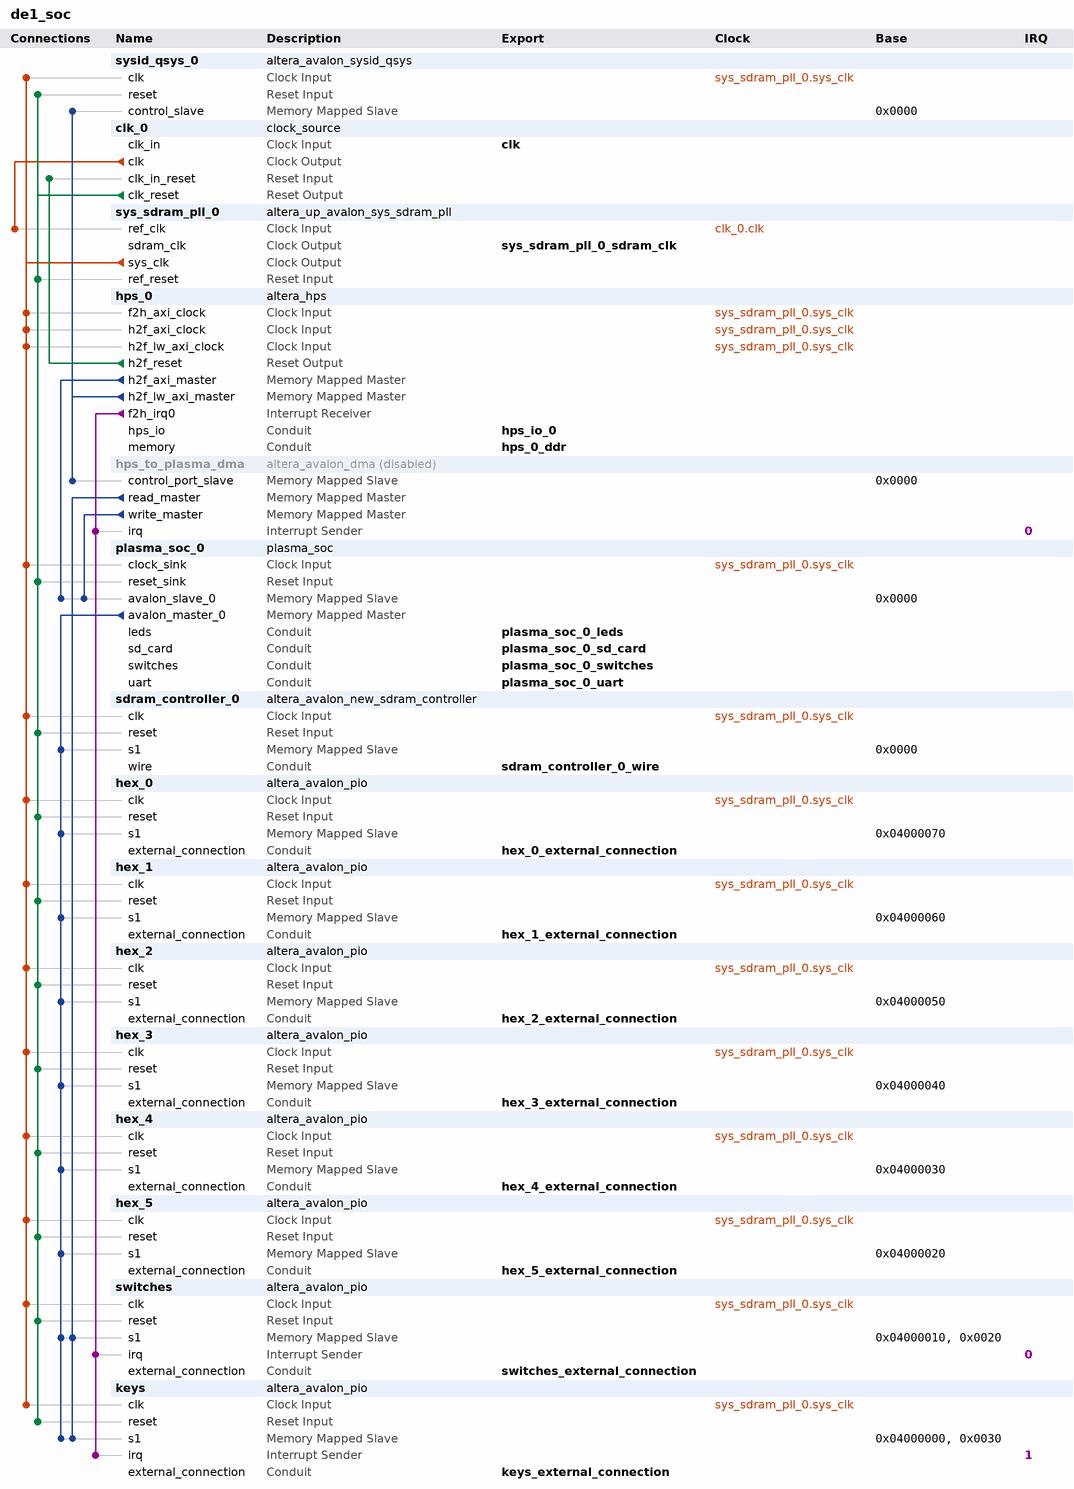
[diagram p0: system contents]
# Platform Designer (Qsys) system de1_soc, Cyclone V 5CSEMA5F31C6
# Parameters at their usual value, and those the tool derives, are not listed.
package require -exact qsys 18.0
create_system de1_soc
set_project_property DEVICE_FAMILY {Cyclone V}
set_project_property DEVICE 5CSEMA5F31C6

add_instance sysid_qsys_0 altera_avalon_sysid_qsys 18.0
set_instance_parameter_value sysid_qsys_0 id -559038737

add_instance clk_0 clock_source 18.0
set_instance_parameter_value clk_0 clockFrequency 50000000

add_instance sys_sdram_pll_0 altera_up_avalon_sys_sdram_pll 18.0
set_instance_parameter_value sys_sdram_pll_0 CV_boards DE1-SoC
set_instance_parameter_value sys_sdram_pll_0 gui_outclk 50.0
set_instance_parameter_value sys_sdram_pll_0 gui_refclk 50.0

add_instance hps_0 altera_hps 18.0
set_instance_parameter_value hps_0 EMAC1_Mode RGMII
set_instance_parameter_value hps_0 EMAC1_PinMuxing {HPS I/O Set 0}
set_instance_parameter_value hps_0 F2SCLK_COLDRST_Enable false
set_instance_parameter_value hps_0 F2SCLK_DBGRST_Enable false
set_instance_parameter_value hps_0 F2SCLK_WARMRST_Enable false
set_instance_parameter_value hps_0 F2SINTERRUPT_Enable true
set_instance_parameter_value hps_0 F2S_Width 3
set_instance_parameter_value hps_0 FPGA_PERIPHERAL_OUTPUT_CLOCK_FREQ_EMAC0_GTX_CLK 125
set_instance_parameter_value hps_0 FPGA_PERIPHERAL_OUTPUT_CLOCK_FREQ_EMAC0_MD_CLK 2.5
set_instance_parameter_value hps_0 FPGA_PERIPHERAL_OUTPUT_CLOCK_FREQ_EMAC1_GTX_CLK 125
set_instance_parameter_value hps_0 FPGA_PERIPHERAL_OUTPUT_CLOCK_FREQ_EMAC1_MD_CLK 2.5
set_instance_parameter_value hps_0 HPS_PROTOCOL DDR3
set_instance_parameter_value hps_0 I2C0_Mode I2C
set_instance_parameter_value hps_0 I2C0_PinMuxing {HPS I/O Set 0}
set_instance_parameter_value hps_0 I2C1_Mode I2C
set_instance_parameter_value hps_0 I2C1_PinMuxing {HPS I/O Set 0}
set_instance_parameter_value hps_0 LWH2F_Enable true
set_instance_parameter_value hps_0 MEM_BANKADDR_WIDTH 3
set_instance_parameter_value hps_0 MEM_CLK_FREQ 400.0
set_instance_parameter_value hps_0 MEM_COL_ADDR_WIDTH 10
set_instance_parameter_value hps_0 MEM_DQ_WIDTH 32
set_instance_parameter_value hps_0 MEM_DRV_STR RZQ/7
set_instance_parameter_value hps_0 MEM_ROW_ADDR_WIDTH 15
set_instance_parameter_value hps_0 MEM_RTT_NOM RZQ/4
set_instance_parameter_value hps_0 MEM_RTT_WR RZQ/4
set_instance_parameter_value hps_0 MEM_TCL 11
set_instance_parameter_value hps_0 MEM_TFAW_NS 30.0
set_instance_parameter_value hps_0 MEM_TRAS_NS 35.0
set_instance_parameter_value hps_0 MEM_TRCD_NS 13.75
set_instance_parameter_value hps_0 MEM_TRFC_NS 260.0
set_instance_parameter_value hps_0 MEM_TRP_NS 13.75
set_instance_parameter_value hps_0 MEM_VENDOR Other
set_instance_parameter_value hps_0 MEM_WTCL 8
set_instance_parameter_value hps_0 QSPI_Mode {1 SS}
set_instance_parameter_value hps_0 QSPI_PinMuxing {HPS I/O Set 0}
set_instance_parameter_value hps_0 REF_CLK_FREQ 50.0
set_instance_parameter_value hps_0 S2FCLK_USER2CLK 5
set_instance_parameter_value hps_0 S2F_Width 3
set_instance_parameter_value hps_0 SDIO_Mode {4-bit Data}
set_instance_parameter_value hps_0 SDIO_PinMuxing {HPS I/O Set 0}
set_instance_parameter_value hps_0 SPIM1_Mode {Single Slave Select}
set_instance_parameter_value hps_0 SPIM1_PinMuxing {HPS I/O Set 0}
set_instance_parameter_value hps_0 STM_Enable false
set_instance_parameter_value hps_0 TIMING_BOARD_AC_SKEW 0.02
set_instance_parameter_value hps_0 TIMING_BOARD_AC_TO_CK_SKEW 0.01
set_instance_parameter_value hps_0 TIMING_BOARD_DQ_TO_DQS_SKEW 0.05
set_instance_parameter_value hps_0 TIMING_BOARD_MAX_CK_DELAY 0.03
set_instance_parameter_value hps_0 TIMING_BOARD_MAX_DQS_DELAY 0.02
set_instance_parameter_value hps_0 TIMING_BOARD_SKEW_BETWEEN_DQS 0.06
set_instance_parameter_value hps_0 TIMING_BOARD_SKEW_CKDQS_DIMM_MAX 0.12
set_instance_parameter_value hps_0 TIMING_BOARD_SKEW_CKDQS_DIMM_MIN 0.06
set_instance_parameter_value hps_0 TIMING_BOARD_SKEW_WITHIN_DQS 0.01
set_instance_parameter_value hps_0 TIMING_TDH 65
set_instance_parameter_value hps_0 TIMING_TDQSCK 255
set_instance_parameter_value hps_0 TIMING_TDQSQ 125
set_instance_parameter_value hps_0 TIMING_TDS 30
set_instance_parameter_value hps_0 TIMING_TIH 140
set_instance_parameter_value hps_0 TIMING_TIS 180
set_instance_parameter_value hps_0 TIMING_TQSH 0.4
set_instance_parameter_value hps_0 UART0_Mode {No Flow Control}
set_instance_parameter_value hps_0 UART0_PinMuxing {HPS I/O Set 0}
set_instance_parameter_value hps_0 USB1_Mode SDR
set_instance_parameter_value hps_0 USB1_PinMuxing {HPS I/O Set 0}
set_instance_parameter_value hps_0 desired_cfg_clk_mhz 100.0
set_instance_parameter_value hps_0 desired_qspi_clk_mhz 400.0

add_instance hps_to_plasma_dma altera_avalon_dma 18.0
set_instance_property hps_to_plasma_dma ENABLED false
set_instance_parameter_value hps_to_plasma_dma allowByteTransactions true
set_instance_parameter_value hps_to_plasma_dma allowDoubleWordTransactions true
set_instance_parameter_value hps_to_plasma_dma allowHalfWordTransactions true
set_instance_parameter_value hps_to_plasma_dma allowQuadWordTransactions true
set_instance_parameter_value hps_to_plasma_dma burstEnable false
set_instance_parameter_value hps_to_plasma_dma fifoDepth 32
set_instance_parameter_value hps_to_plasma_dma maxBurstSize 128
set_instance_parameter_value hps_to_plasma_dma minimumDmaTransactionRegisterWidth 13

add_instance plasma_soc_0 plasma_soc 1.0

add_instance sdram_controller_0 altera_avalon_new_sdram_controller 18.0
set_instance_parameter_value sdram_controller_0 TAC 5.4
set_instance_parameter_value sdram_controller_0 TRCD 15.0
set_instance_parameter_value sdram_controller_0 TRP 15.0
set_instance_parameter_value sdram_controller_0 casLatency 3
set_instance_parameter_value sdram_controller_0 columnWidth 10
set_instance_parameter_value sdram_controller_0 dataWidth 16
set_instance_parameter_value sdram_controller_0 generateSimulationModel true
set_instance_parameter_value sdram_controller_0 model single_Micron_MT48LC4M32B2_7_chip
set_instance_parameter_value sdram_controller_0 numberOfBanks 4
set_instance_parameter_value sdram_controller_0 numberOfChipSelects 1
set_instance_parameter_value sdram_controller_0 powerUpDelay 100.0
set_instance_parameter_value sdram_controller_0 refreshPeriod 7.8125
set_instance_parameter_value sdram_controller_0 rowWidth 13

add_instance hex_0 altera_avalon_pio 18.0
set_instance_parameter_value hex_0 direction Output
set_instance_parameter_value hex_0 width 7

add_instance hex_1 altera_avalon_pio 18.0
set_instance_parameter_value hex_1 direction Output
set_instance_parameter_value hex_1 width 7

add_instance hex_2 altera_avalon_pio 18.0
set_instance_parameter_value hex_2 direction Output
set_instance_parameter_value hex_2 width 7

add_instance hex_3 altera_avalon_pio 18.0
set_instance_parameter_value hex_3 direction Output
set_instance_parameter_value hex_3 width 7

add_instance hex_4 altera_avalon_pio 18.0
set_instance_parameter_value hex_4 direction Output
set_instance_parameter_value hex_4 width 7

add_instance hex_5 altera_avalon_pio 18.0
set_instance_parameter_value hex_5 direction Output
set_instance_parameter_value hex_5 width 7

add_instance switches altera_avalon_pio 18.0
set_instance_parameter_value switches direction Input
set_instance_parameter_value switches generateIRQ true
set_instance_parameter_value switches width 10

add_instance keys altera_avalon_pio 18.0
set_instance_parameter_value keys direction Input
set_instance_parameter_value keys generateIRQ true
set_instance_parameter_value keys width 4

# connections
add_connection clk_0.clk sys_sdram_pll_0.ref_clk clock
add_connection sys_sdram_pll_0.sys_clk hex_0.clk clock
add_connection sys_sdram_pll_0.sys_clk hex_1.clk clock
add_connection sys_sdram_pll_0.sys_clk hex_2.clk clock
add_connection sys_sdram_pll_0.sys_clk hex_3.clk clock
add_connection sys_sdram_pll_0.sys_clk hex_4.clk clock
add_connection sys_sdram_pll_0.sys_clk hex_5.clk clock
add_connection sys_sdram_pll_0.sys_clk hps_0.f2h_axi_clock clock
add_connection sys_sdram_pll_0.sys_clk hps_0.h2f_axi_clock clock
add_connection sys_sdram_pll_0.sys_clk hps_0.h2f_lw_axi_clock clock
add_connection sys_sdram_pll_0.sys_clk keys.clk clock
add_connection sys_sdram_pll_0.sys_clk plasma_soc_0.clock_sink clock
add_connection sys_sdram_pll_0.sys_clk sdram_controller_0.clk clock
add_connection sys_sdram_pll_0.sys_clk switches.clk clock
add_connection sys_sdram_pll_0.sys_clk sysid_qsys_0.clk clock
add_connection clk_0.clk_reset hex_0.reset reset
add_connection clk_0.clk_reset hex_1.reset reset
add_connection clk_0.clk_reset hex_2.reset reset
add_connection clk_0.clk_reset hex_3.reset reset
add_connection clk_0.clk_reset hex_4.reset reset
add_connection clk_0.clk_reset hex_5.reset reset
add_connection clk_0.clk_reset keys.reset reset
add_connection clk_0.clk_reset plasma_soc_0.reset_sink reset
add_connection clk_0.clk_reset sdram_controller_0.reset reset
add_connection clk_0.clk_reset switches.reset reset
add_connection clk_0.clk_reset sys_sdram_pll_0.ref_reset reset
add_connection clk_0.clk_reset sysid_qsys_0.reset reset
add_connection hps_0.h2f_reset clk_0.clk_in_reset reset
add_connection hps_0.h2f_axi_master plasma_soc_0.avalon_slave_0 avalon
set_connection_parameter_value hps_0.h2f_axi_master/plasma_soc_0.avalon_slave_0 baseAddress 0x0000
add_connection hps_0.h2f_lw_axi_master hps_to_plasma_dma.control_port_slave avalon
set_connection_parameter_value hps_0.h2f_lw_axi_master/hps_to_plasma_dma.control_port_slave baseAddress 0x0000
add_connection hps_0.h2f_lw_axi_master sysid_qsys_0.control_slave avalon
set_connection_parameter_value hps_0.h2f_lw_axi_master/sysid_qsys_0.control_slave baseAddress 0x0000
add_connection hps_to_plasma_dma.read_master keys.s1 avalon
set_connection_parameter_value hps_to_plasma_dma.read_master/keys.s1 baseAddress 0x0030
add_connection hps_to_plasma_dma.read_master switches.s1 avalon
set_connection_parameter_value hps_to_plasma_dma.read_master/switches.s1 baseAddress 0x0020
add_connection hps_to_plasma_dma.write_master plasma_soc_0.avalon_slave_0 avalon
set_connection_parameter_value hps_to_plasma_dma.write_master/plasma_soc_0.avalon_slave_0 baseAddress 0x0000
add_connection plasma_soc_0.avalon_master_0 hex_0.s1 avalon
set_connection_parameter_value plasma_soc_0.avalon_master_0/hex_0.s1 baseAddress 0x04000070
add_connection plasma_soc_0.avalon_master_0 hex_1.s1 avalon
set_connection_parameter_value plasma_soc_0.avalon_master_0/hex_1.s1 baseAddress 0x04000060
add_connection plasma_soc_0.avalon_master_0 hex_2.s1 avalon
set_connection_parameter_value plasma_soc_0.avalon_master_0/hex_2.s1 baseAddress 0x04000050
add_connection plasma_soc_0.avalon_master_0 hex_3.s1 avalon
set_connection_parameter_value plasma_soc_0.avalon_master_0/hex_3.s1 baseAddress 0x04000040
add_connection plasma_soc_0.avalon_master_0 hex_4.s1 avalon
set_connection_parameter_value plasma_soc_0.avalon_master_0/hex_4.s1 baseAddress 0x04000030
add_connection plasma_soc_0.avalon_master_0 hex_5.s1 avalon
set_connection_parameter_value plasma_soc_0.avalon_master_0/hex_5.s1 baseAddress 0x04000020
add_connection plasma_soc_0.avalon_master_0 keys.s1 avalon
set_connection_parameter_value plasma_soc_0.avalon_master_0/keys.s1 baseAddress 0x04000000
add_connection plasma_soc_0.avalon_master_0 sdram_controller_0.s1 avalon
set_connection_parameter_value plasma_soc_0.avalon_master_0/sdram_controller_0.s1 baseAddress 0x0000
add_connection plasma_soc_0.avalon_master_0 switches.s1 avalon
set_connection_parameter_value plasma_soc_0.avalon_master_0/switches.s1 baseAddress 0x04000010
add_connection hps_0.f2h_irq0 hps_to_plasma_dma.irq interrupt
set_connection_parameter_value hps_0.f2h_irq0/hps_to_plasma_dma.irq irqNumber 0
add_connection hps_0.f2h_irq0 keys.irq interrupt
set_connection_parameter_value hps_0.f2h_irq0/keys.irq irqNumber 1
add_connection hps_0.f2h_irq0 switches.irq interrupt
set_connection_parameter_value hps_0.f2h_irq0/switches.irq irqNumber 0

# exported interfaces
add_interface clk clock sink
set_interface_property clk EXPORT_OF clk_0.clk_in
add_interface hex_0_external_connection conduit end
set_interface_property hex_0_external_connection EXPORT_OF hex_0.external_connection
add_interface hex_1_external_connection conduit end
set_interface_property hex_1_external_connection EXPORT_OF hex_1.external_connection
add_interface hex_2_external_connection conduit end
set_interface_property hex_2_external_connection EXPORT_OF hex_2.external_connection
add_interface hex_3_external_connection conduit end
set_interface_property hex_3_external_connection EXPORT_OF hex_3.external_connection
add_interface hex_4_external_connection conduit end
set_interface_property hex_4_external_connection EXPORT_OF hex_4.external_connection
add_interface hex_5_external_connection conduit end
set_interface_property hex_5_external_connection EXPORT_OF hex_5.external_connection
add_interface hps_0_ddr conduit end
set_interface_property hps_0_ddr EXPORT_OF hps_0.memory
add_interface hps_io_0 conduit end
set_interface_property hps_io_0 EXPORT_OF hps_0.hps_io
add_interface keys_external_connection conduit end
set_interface_property keys_external_connection EXPORT_OF keys.external_connection
add_interface plasma_soc_0_leds conduit end
set_interface_property plasma_soc_0_leds EXPORT_OF plasma_soc_0.leds
add_interface plasma_soc_0_sd_card conduit end
set_interface_property plasma_soc_0_sd_card EXPORT_OF plasma_soc_0.sd_card
add_interface plasma_soc_0_switches conduit end
set_interface_property plasma_soc_0_switches EXPORT_OF plasma_soc_0.switches
add_interface plasma_soc_0_uart conduit end
set_interface_property plasma_soc_0_uart EXPORT_OF plasma_soc_0.uart
add_interface sdram_controller_0_wire conduit end
set_interface_property sdram_controller_0_wire EXPORT_OF sdram_controller_0.wire
add_interface switches_external_connection conduit end
set_interface_property switches_external_connection EXPORT_OF switches.external_connection
add_interface sys_sdram_pll_0_sdram_clk clock source
set_interface_property sys_sdram_pll_0_sdram_clk EXPORT_OF sys_sdram_pll_0.sdram_clk

set_interconnect_requirement {$system} qsys_mm.clockCrossingAdapter HANDSHAKE
set_interconnect_requirement {$system} qsys_mm.enableEccProtection FALSE
set_interconnect_requirement {$system} qsys_mm.insertDefaultSlave FALSE
set_interconnect_requirement {$system} qsys_mm.maxAdditionalLatency 1

save_system de1_soc.qsys
